# EAGLE design MKRProtoShield_V2.0 (EAGLE 9.1.3)
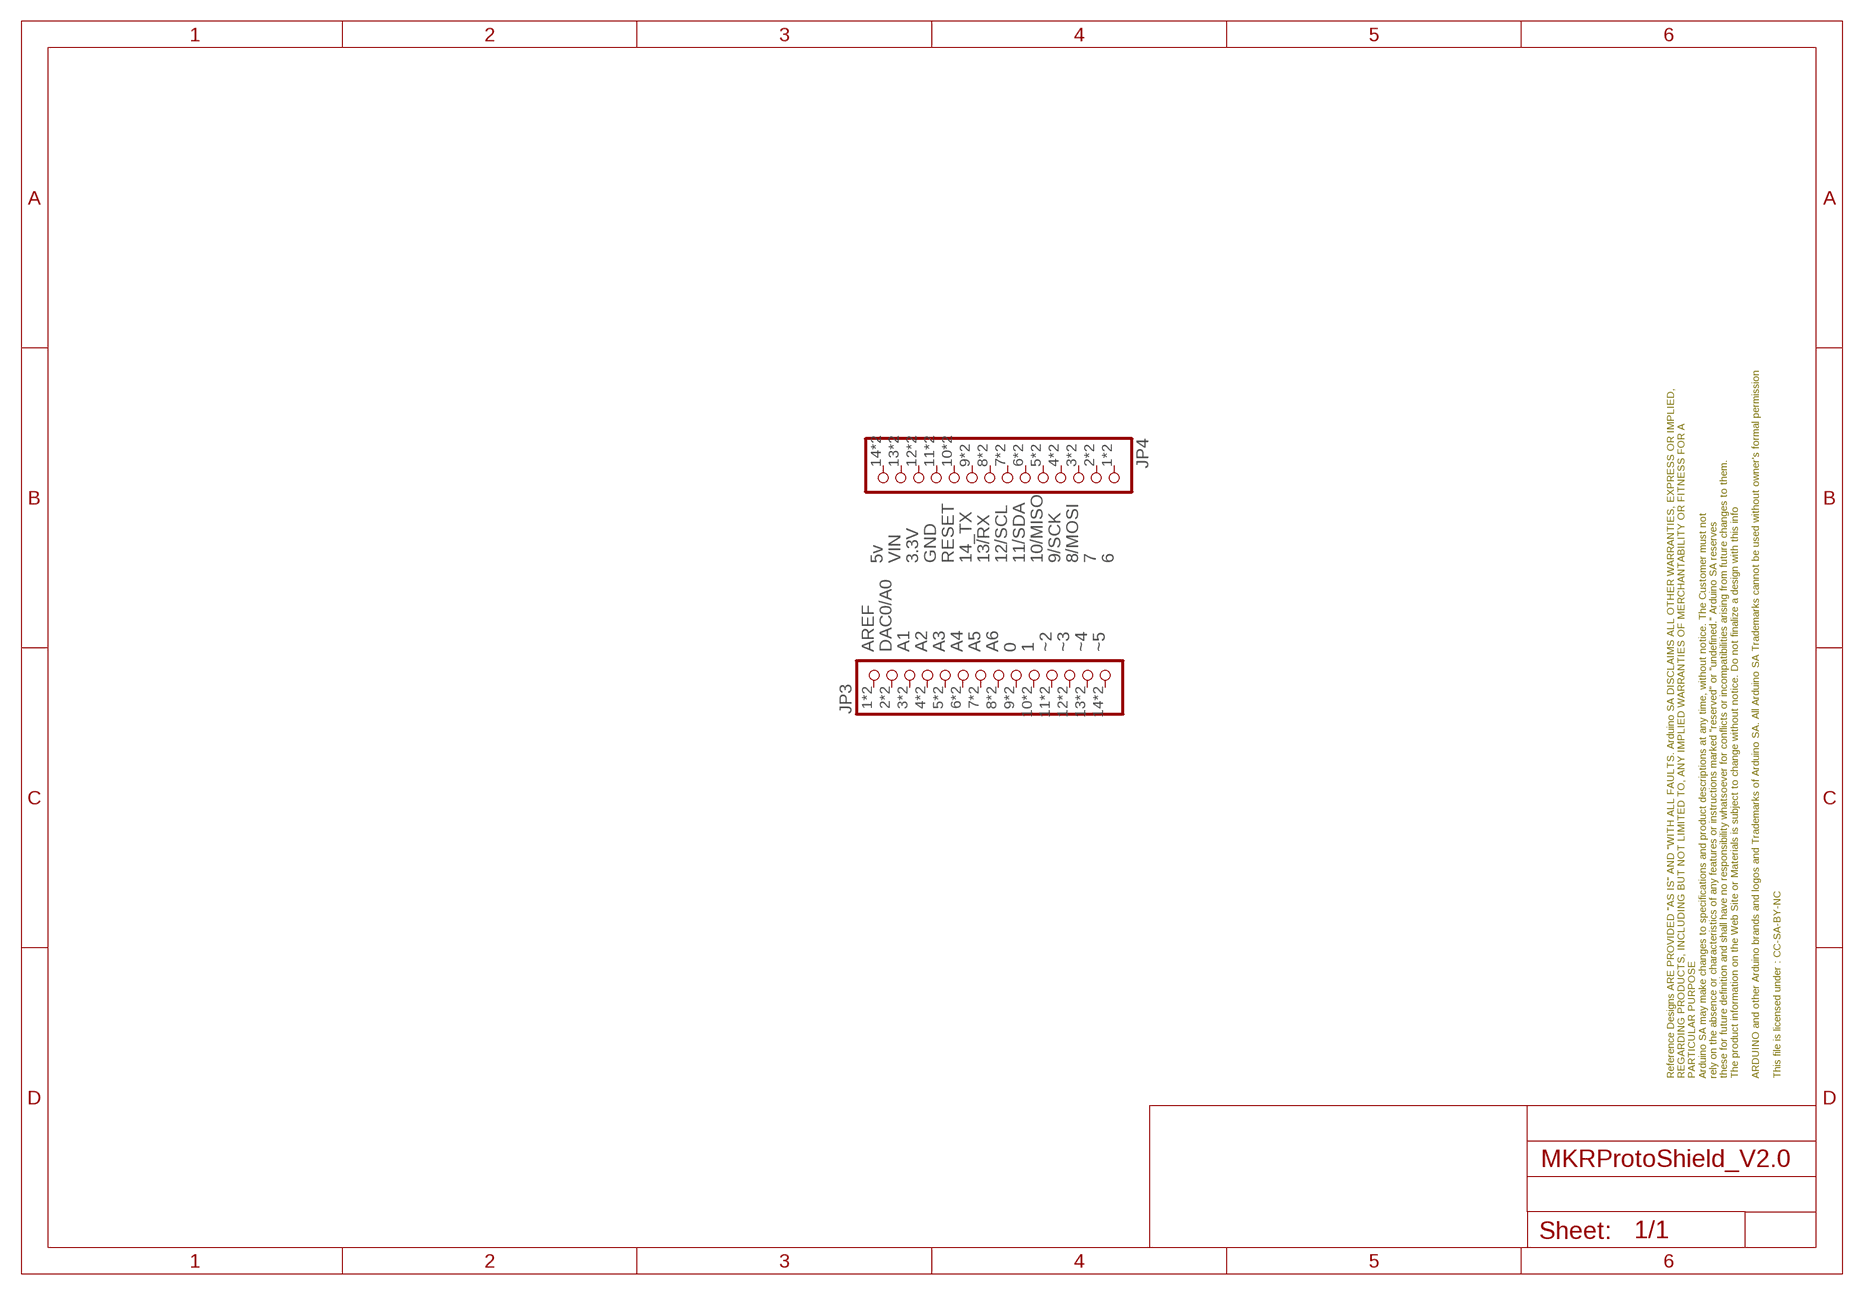
[diagram p0: schematic, sheet 1]

## Parts
FRAME1  DNP  A4L-LOC  [FRAME]
JP3  PINHD-1X14DOUBLE  [1X14-DOUBLE]
JP4  PINHD-1X14DOUBLE  [1X14-DOUBLE]
Unconnected: JP3.1 JP3.2 JP3.3 JP3.4 JP3.5 JP3.6 JP3.7 JP3.8 JP3.9 JP3.10 JP3.11 JP3.12 JP3.13 JP3.14 JP3.15 JP3.16 JP3.17 JP3.18 JP3.19 JP3.20 JP3.21 JP3.22 JP3.23 JP3.24 JP3.25 JP3.26 JP3.27 JP3.28 JP4.1 JP4.2 JP4.3 JP4.4 JP4.5 JP4.6 JP4.7 JP4.8 JP4.9 JP4.10 JP4.11 JP4.12 JP4.13 JP4.14 JP4.15 JP4.16 JP4.17 JP4.18 JP4.19 JP4.20 JP4.21 JP4.22 JP4.23 JP4.24 JP4.25 JP4.26 JP4.27 JP4.28

## Notes on the sheet
- 5v | VIN | 3.3V | GND | RESET | 14_TX | 13/RX | 12/SCL | 11/SDA | 10/MISO | 9/SCK | 8/MOSI | 7 | 6
- AREF | DAC0/A0 | A1 | A2 | A3 | A4 | A5 | A6 | 0 | 1 | ~2 | ~3 | ~4 | ~5

## Library data of the parts
FRAME1 = Arduino-utility:A4L-LOC: FRAME DIN A4, landscape with location and doc. field; CODE-ARDUINO: DNP; DATASHEET: DNP; DISTRIBUTOR-LINK: DNP; DISTRIBUTOR-PN: DNP; MANUFACTURER: DNP; MANUFACTURER-PN: DNP
JP3 JP4 = Arduino-connectors:PINHD-1X14: PIN HEADER

## Board
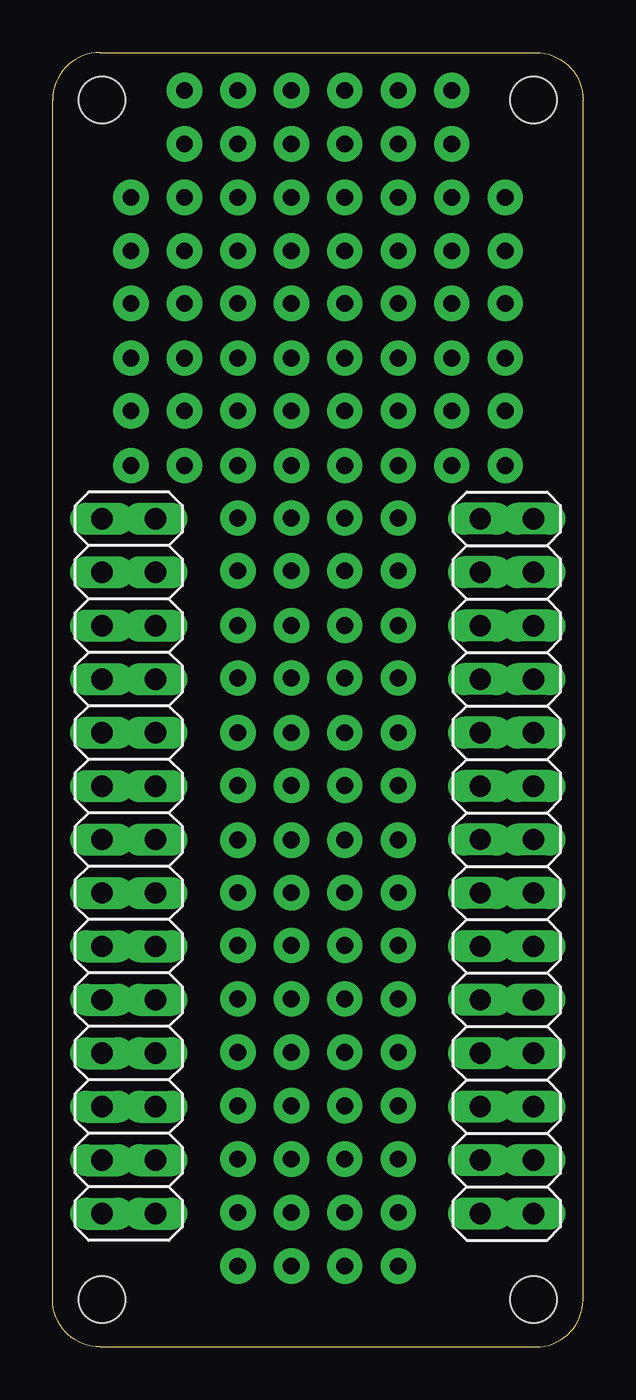
[diagram p1: board, top side]

Size 25.2 x 61.5 mm. Coordinates in mm from the lower left corner, seen from the top.
Outline: 25.2,2.25 25.2,59.25 arc90 22.95,61.5 2.25,61.5 arc90 0,59.25 0,2.25 arc90 2.25,0 22.95,0 arc90 25.2,2.25
Copper layers (1*16): Top 0.035mm / dielectric 1.5mm / Bottom 0.035mm
Design rules "SeeedStudio_2layers": minimum track width 6mil, minimum drill 12mil, track to track 6mil, track to pad 6mil, pad to pad 6mil, via to via 6mil, smd to smd 0mil, copper to edge 10mil, drill to drill 10mil, minimum pad ring 10mil, minimum via ring 6mil, stop-mask expansion 2mil, vias tented up to drill 100mil, thermal gap 10mil
Holes 2.2 mm at 2.35,2.25 22.85,2.25 2.35,59.25 22.85,59.25

### Footprints (pad centres in the part's own frame; a part is rotated, then mirrored left to right if it is on the bottom)
1X14-DOUBLE = drill 1.016 long: 1 -16.51,0; 2 -13.97,0; 3 -11.43,0; 4 -8.89,0; 5 -6.35,0; 6 -3.81,0; 7 -1.27,0; 8 1.27,0; 9 3.81,0; 10 6.35,0; 11 8.89,0; 12 11.43,0; 13 13.97,0; 14 16.51,0; 15 -16.51,2.54; 16 -13.97,2.54; 17 -11.43,2.54; 18 -8.89,2.54; 19 -6.35,2.54; 20 -3.81,2.54; 21 -1.27,2.54; 22 1.27,2.54; 23 3.81,2.54; 24 6.35,2.54; 25 8.89,2.54; 26 11.43,2.54; 27 13.97,2.54; 28 16.51,2.54

### Placement (x,y rotation side)
FRAME1  2.54,-5.08 0 top  (outside the outline)
JP3  2.35,22.84 270 top
JP4  22.85,22.84 90 top

### Tracks (layer width: path | path; a pad name or v marks a point on that pad's centre or on a via)
N$1  (via drill 0.8 pad 1.68)
  other vias: 11.34,39.38
N$6  (via drill 0.8 pad 1.68)
  other vias: 16.42,36.88
N$7  (via drill 0.8 pad 1.68)
  other vias: 11.34,34.28
N$8  (via drill 0.8 pad 1.68)
  other vias: 16.42,31.78
N$9  (via drill 0.8 pad 1.68)
  other vias: 11.34,29.18
N$10  (via drill 0.8 pad 1.68)
  other vias: 16.42,26.68
N$11  (via drill 0.8 pad 1.68)
  other vias: 11.34,24.08
N$12  (via drill 0.8 pad 1.68)
  other vias: 16.42,21.58
N$13  (via drill 0.8 pad 1.68)
  other vias: 13.88,19.08
N$14  (via drill 0.8 pad 1.68)
  other vias: 16.42,52.08
N$15  (via drill 0.8 pad 1.68)
  other vias: 11.34,49.58
N$16  (via drill 0.8 pad 1.68)
  other vias: 16.42,46.98
N$17  (via drill 0.8 pad 1.68)
  other vias: 11.34,44.48
N$18  (via drill 0.8 pad 1.68)
  other vias: 16.42,41.88
N$19  (via drill 0.8 pad 1.68)
  other vias: 6.26,52.08
N$20  (via drill 0.8 pad 1.68)
  other vias: 6.26,49.58
N$21  (via drill 0.8 pad 1.68)
  other vias: 6.26,46.98
N$22  (via drill 0.8 pad 1.68)
  other vias: 6.26,44.48
N$34  (via drill 0.8 pad 1.68)
  other vias: 6.26,41.88
N$35  (via drill 0.8 pad 1.68)
  other vias: 3.72,52.08
N$36  (via drill 0.8 pad 1.68)
  other vias: 3.72,49.58
N$37  (via drill 0.8 pad 1.68)
  other vias: 3.72,46.98
N$38  (via drill 0.8 pad 1.68)
  other vias: 3.72,44.48
N$39  (via drill 0.8 pad 1.68)
  other vias: 3.72,41.88
N$40  (via drill 0.8 pad 1.68)
  other vias: 18.96,52.08
N$41  (via drill 0.8 pad 1.68)
  other vias: 18.96,49.58
N$42  (via drill 0.8 pad 1.68)
  other vias: 18.96,46.98
N$43  (via drill 0.8 pad 1.68)
  other vias: 18.96,44.48
N$44  (via drill 0.8 pad 1.68)
  other vias: 18.96,41.88
N$45  (via drill 0.8 pad 1.68)
  other vias: 21.5,52.08
N$46  (via drill 0.8 pad 1.68)
  other vias: 21.5,49.58
N$47  (via drill 0.8 pad 1.68)
  other vias: 21.5,46.98
N$48  (via drill 0.8 pad 1.68)
  other vias: 21.5,44.48
N$49  (via drill 0.8 pad 1.68)
  other vias: 21.5,41.88
N$50  (via drill 0.8 pad 1.68)
  other vias: 11.34,57.16
N$51  (via drill 0.8 pad 1.68)
  other vias: 6.26,54.62
N$52  (via drill 0.8 pad 1.68)
  other vias: 3.72,54.62
N$53  (via drill 0.8 pad 1.68)
  other vias: 18.96,54.62
N$54  (via drill 0.8 pad 1.68)
  other vias: 21.5,54.62
N$55  (via drill 0.8 pad 1.68)
  other vias: 8.8,59.7
N$56  (via drill 0.8 pad 1.68)
  other vias: 6.26,59.7
N$58  (via drill 0.8 pad 1.68)
  other vias: 18.96,57.16
N$60  (via drill 0.8 pad 1.68)
  other vias: 8.8,21.58
N$61  (via drill 0.8 pad 1.68)
  other vias: 11.34,21.58
N$62  (via drill 0.8 pad 1.68)
  other vias: 13.88,21.58
N$63  (via drill 0.8 pad 1.68)
  other vias: 16.42,24.08
N$64  (via drill 0.8 pad 1.68)
  other vias: 13.88,24.08
N$65  (via drill 0.8 pad 1.68)
  other vias: 8.8,26.68
N$66  (via drill 0.8 pad 1.68)
  other vias: 8.8,24.08
N$67  (via drill 0.8 pad 1.68)
  other vias: 11.34,26.68
N$68  (via drill 0.8 pad 1.68)
  other vias: 13.88,26.68
N$69  (via drill 0.8 pad 1.68)
  other vias: 16.42,29.18
N$70  (via drill 0.8 pad 1.68)
  other vias: 13.88,29.18
N$71  (via drill 0.8 pad 1.68)
  other vias: 8.8,29.18
N$72  (via drill 0.8 pad 1.68)
  other vias: 8.8,31.78
N$73  (via drill 0.8 pad 1.68)
  other vias: 11.34,31.78
N$74  (via drill 0.8 pad 1.68)
  other vias: 13.88,31.78
N$75  (via drill 0.8 pad 1.68)
  other vias: 16.42,34.28
N$76  (via drill 0.8 pad 1.68)
  other vias: 13.88,34.28
N$77  (via drill 0.8 pad 1.68)
  other vias: 8.8,34.28
N$78  (via drill 0.8 pad 1.68)
  other vias: 8.8,36.88
N$79  (via drill 0.8 pad 1.68)
  other vias: 11.34,36.88
N$80  (via drill 0.8 pad 1.68)
  other vias: 13.88,36.88
N$81  (via drill 0.8 pad 1.68)
  other vias: 16.42,39.38
N$82  (via drill 0.8 pad 1.68)
  other vias: 13.88,39.38
N$83  (via drill 0.8 pad 1.68)
  other vias: 8.8,39.38
N$84  (via drill 0.8 pad 1.68)
  other vias: 8.8,41.88
N$85  (via drill 0.8 pad 1.68)
  other vias: 11.34,41.88
N$86  (via drill 0.8 pad 1.68)
  other vias: 13.88,41.88
N$87  (via drill 0.8 pad 1.68)
  other vias: 16.42,44.48
N$88  (via drill 0.8 pad 1.68)
  other vias: 13.88,44.48
N$89  (via drill 0.8 pad 1.68)
  other vias: 8.8,44.48
N$90  (via drill 0.8 pad 1.68)
  other vias: 8.8,46.98
N$91  (via drill 0.8 pad 1.68)
  other vias: 11.34,46.98
N$92  (via drill 0.8 pad 1.68)
  other vias: 13.88,46.98
N$93  (via drill 0.8 pad 1.68)
  other vias: 16.42,49.58
N$94  (via drill 0.8 pad 1.68)
  other vias: 13.88,49.58
N$95  (via drill 0.8 pad 1.68)
  other vias: 8.8,49.58
N$96  (via drill 0.8 pad 1.68)
  other vias: 8.8,54.62
N$97  (via drill 0.8 pad 1.68)
  other vias: 16.42,59.7
N$98  (via drill 0.8 pad 1.68)
  other vias: 13.88,52.08
N$99  (via drill 0.8 pad 1.68)
  other vias: 6.26,57.16
N$100  (via drill 0.8 pad 1.68)
  other vias: 8.8,57.16
N$101  (via drill 0.8 pad 1.68)
  other vias: 8.8,52.08
N$102  (via drill 0.8 pad 1.68)
  other vias: 11.34,52.08
N$103  (via drill 0.8 pad 1.68)
  other vias: 11.34,54.62
N$104  (via drill 0.8 pad 1.68)
  other vias: 13.88,54.62
N$105  (via drill 0.8 pad 1.68)
  other vias: 16.42,19.08
N$106  (via drill 0.8 pad 1.68)
  other vias: 8.8,19.08
N$111  (via drill 0.8 pad 1.68)
  other vias: 11.34,19.08
N$116  (via drill 0.8 pad 1.68)
  other vias: 16.42,16.54
N$117  (via drill 0.8 pad 1.68)
  other vias: 8.8,16.54
N$118  (via drill 0.8 pad 1.68)
  other vias: 11.34,16.54
N$119  (via drill 0.8 pad 1.68)
  other vias: 13.88,16.54
N$120  (via drill 0.8 pad 1.68)
  other vias: 16.42,14
N$121  (via drill 0.8 pad 1.68)
  other vias: 8.8,14
N$122  (via drill 0.8 pad 1.68)
  other vias: 11.34,14
N$123  (via drill 0.8 pad 1.68)
  other vias: 13.88,14
N$124  (via drill 0.8 pad 1.68)
  other vias: 16.42,11.46
N$125  (via drill 0.8 pad 1.68)
  other vias: 8.8,11.46
N$126  (via drill 0.8 pad 1.68)
  other vias: 11.34,11.46
N$127  (via drill 0.8 pad 1.68)
  other vias: 13.88,11.46
N$128  (via drill 0.8 pad 1.68)
  other vias: 16.42,8.92
N$129  (via drill 0.8 pad 1.68)
  other vias: 8.8,8.92
N$130  (via drill 0.8 pad 1.68)
  other vias: 11.34,8.92
N$131  (via drill 0.8 pad 1.68)
  other vias: 13.88,8.92
N$132  (via drill 0.8 pad 1.68)
  other vias: 16.42,6.38
N$133  (via drill 0.8 pad 1.68)
  other vias: 8.8,6.38
N$134  (via drill 0.8 pad 1.68)
  other vias: 11.34,6.38
N$135  (via drill 0.8 pad 1.68)
  other vias: 13.88,6.38
N$136  (via drill 0.8 pad 1.68)
  other vias: 16.42,3.84
N$137  (via drill 0.8 pad 1.68)
  other vias: 8.8,3.84
N$138  (via drill 0.8 pad 1.68)
  other vias: 11.34,3.84
N$139  (via drill 0.8 pad 1.68)
  other vias: 13.88,3.84
N$140  (via drill 0.8 pad 1.68)
  other vias: 13.88,57.16
N$141  (via drill 0.8 pad 1.68)
  other vias: 11.34,59.7
N$142  (via drill 0.8 pad 1.68)
  other vias: 13.88,59.7
N$143  (via drill 0.8 pad 1.68)
  other vias: 18.96,59.7
N$144  (via drill 0.8 pad 1.68)
  other vias: 16.42,57.16
N$145  (via drill 0.8 pad 1.68)
  other vias: 16.42,54.62